# EAGLE design muster#1 (EAGLE 9.1.3)
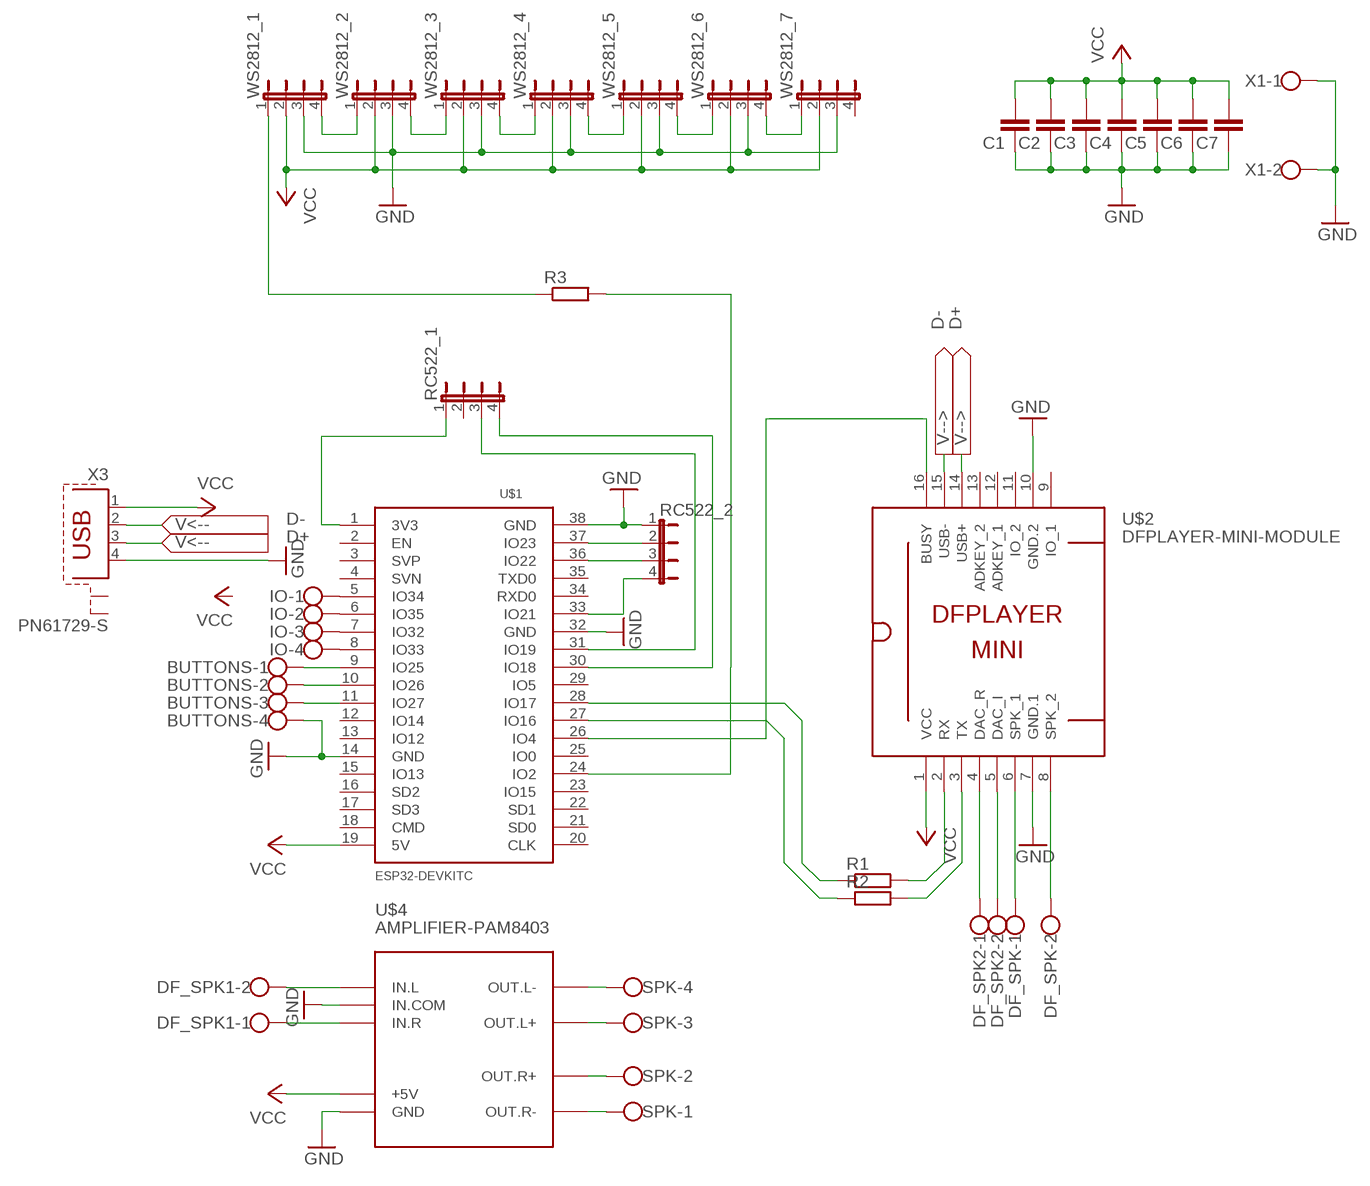
[diagram p0: schematic, sheet 1]

## Parts
BUTTONS  W237-4  [W237-4]
C1  C-EU025-024X044  [C025-024X044]
C2  C-EU025-025X050  [C025-025X050]
C3  C-EU025-025X050  [C025-025X050]
C4  C-EU025-025X050  [C025-025X050]
C5  C-EU025-025X050  [C025-025X050]
C6  C-EU025-025X050  [C025-025X050]
C7  C-EU025-025X050  [C025-025X050]
DF_SPK  W237-02P  [W237-132]
DF_SPK1  W237-02P  [W237-132]
DF_SPK2  W237-02P  [W237-132]
IO  W237-4  [W237-4]
R1  R-EU_0204/2V  [0204V]
R2  R-EU_0204/2V  [0204V]
R3  R-EU_0204/2V  [0204V]
RC522_1  JP4E  [JP4]
RC522_2  JP4E  [JP4]
SPK  W237-4  [W237-4]
U$1  ESP32DEVKITC  [ESP32-DEVKITC]
U$2  DFPLAYER-MINI-MODULE  [DFPLAYER-MINI-MODULE]
U$4  AMPLIFIER-PAM8403  [AMPLIFIER-PAM8403]
WS2812_1  JP4E  [JP4]
WS2812_2  JP4E  [JP4]
WS2812_3  JP4E  [JP4]
WS2812_4  JP4E  [JP4]
WS2812_5  JP4E  [JP4]
WS2812_6  JP4E  [JP4]
WS2812_7  JP4E  [JP4]
X1  W237-102  [W237-102]
X3  PN61729-S  [PN61729-S]

## Nets
D+: U$2.14(USB+) X3.3
D-: U$2.15(USB-) X3.2
GND: BUTTONS.4 C1.1 C2.1 C3.1 C4.1 C5.1 C6.1 C7.1 RC522_2.1 U$1.14(GND) U$1.32(GND) U$1.38(GND) U$2.7(GND.1) U$2.10(GND.2) U$4.GND U$4.IN.COM WS2812_1.3 WS2812_2.3 WS2812_3.3 WS2812_4.3 WS2812_5.3 WS2812_6.3 WS2812_7.3 X1.1 X1.2 X3.4
N$1: DF_SPK.2 U$2.8(SPK_2)
N$2: DF_SPK.1 U$2.6(SPK_1)
N$3: BUTTONS.1 U$1.9(IO25)
N$4: BUTTONS.2 U$1.10(IO26)
N$5: BUTTONS.3 U$1.11(IO27)
N$6: R1.1 U$1.28(IO17)
N$7: R2.1 U$1.27(IO16)
N$8: R2.2 U$2.3(TX)
N$9: WS2812_1.4 WS2812_2.1
N$10: WS2812_2.4 WS2812_3.1
N$11: R1.2 U$2.2(RX)
N$12: SPK.1 U$4.OUT.R-
N$13: DF_SPK2.1 U$2.4(DAC_R)
N$14: R3.1 WS2812_1.1
N$15: SPK.2 U$4.OUT.R+
N$16: SPK.3 U$4.OUT.L+
N$17: SPK.4 U$4.OUT.L-
N$18: WS2812_3.4 WS2812_4.1
N$19: WS2812_4.4 WS2812_5.1
N$20: WS2812_5.4 WS2812_6.1
N$21: WS2812_6.4 WS2812_7.1
N$23: DF_SPK2.2 U$2.5(DAC_I)
N$24: DF_SPK1.2 U$4.IN.L
N$25: DF_SPK1.1 U$4.IN.R
N$26: R3.2 U$1.24(IO2)
N$27: RC522_2.2 U$1.37(IO23)
N$28: U$1.26(IO4) U$2.16(BUSY)
N$29: RC522_2.3 U$1.36(IO22)
N$30: RC522_2.4 U$1.33(IO21)
N$31: RC522_1.3 U$1.31(IO19)
N$32: RC522_1.4 U$1.30(IO18)
N$33: RC522_1.1 U$1.1(3V3)
N$34: IO.1 U$1.5(IO34)
N$35: IO.2 U$1.6(IO35)
N$36: IO.3 U$1.7(IO32)
N$37: IO.4 U$1.8(IO33)
VCC: C1.2 C2.2 C3.2 C4.2 C5.2 C6.2 C7.2 U$1.19(5V) U$2.1(VCC) U$4.+5V WS2812_1.2 WS2812_2.2 WS2812_3.2 WS2812_4.2 WS2812_5.2 WS2812_6.2 WS2812_7.2 X3.1
Unconnected: RC522_1.2 U$1.2(EN) U$1.3(SVP) U$1.4(SVN) U$1.12(IO14) U$1.13(IO12) U$1.15(IO13) U$1.16(SD2) U$1.17(SD3) U$1.18(CMD) U$1.20(CLK) U$1.21(SD0) U$1.22(SD1) U$1.23(IO15) U$1.25(IO0) U$1.29(IO5) U$1.34(RXD0) U$1.35(TXD0) U$2.9(IO_1) U$2.11(IO_2) U$2.12(ADKEY_1) U$2.13(ADKEY_2) WS2812_7.4 X3.S1 X3.S2

## Library data of the parts
BUTTONS IO SPK = con-wago-500:W237-4: WAGO SCREW CLAMP
C1-C7 = resistor:C-EU: CAPACITOR, European symbol
DF_SPK DF_SPK1 DF_SPK2 = con-wago-508:W237-02P: WAGO SREW CLAMP
R1-R3 = rcl:R-EU_: RESISTOR, European symbol
RC522_1 RC522_2 WS2812_1-WS2812_7 = jumper:JP4E: JUMPER
U$1 = ESP32-DEVKITC:ESP32DEVKITC
U$2 = diy-modules:DFPLAYER-MINI-MODULE: DFPlayer Mini - MP3 player module based on YX5200 chip More details available here: https://www.dfrobot.com/wiki/index.php/DFPlayer_Mini_SKU:DFR0299 Click here to find device on ebay.com <http://www.ebay.com/sch/dfplayer+mini>
U$4 = diy-modules:AMPLIFIER-PAM8403: Stereo Class-D 3W Audio Amplifier based on PAM8403 chip More details available here: http://artofcircuits.com/product/pam8403-5v-two-channel-stereo-mini-class-d-3w3w-audio-amplifier Click here to find device on ebay.com <http://www.ebay.com/sch/pam8403+mini+class+d>
X1 = con-wago-500:W237-102: WAGO SCREW CLAMP
X3 = con-berg:PN61729-S: BERG USB connector

## Board
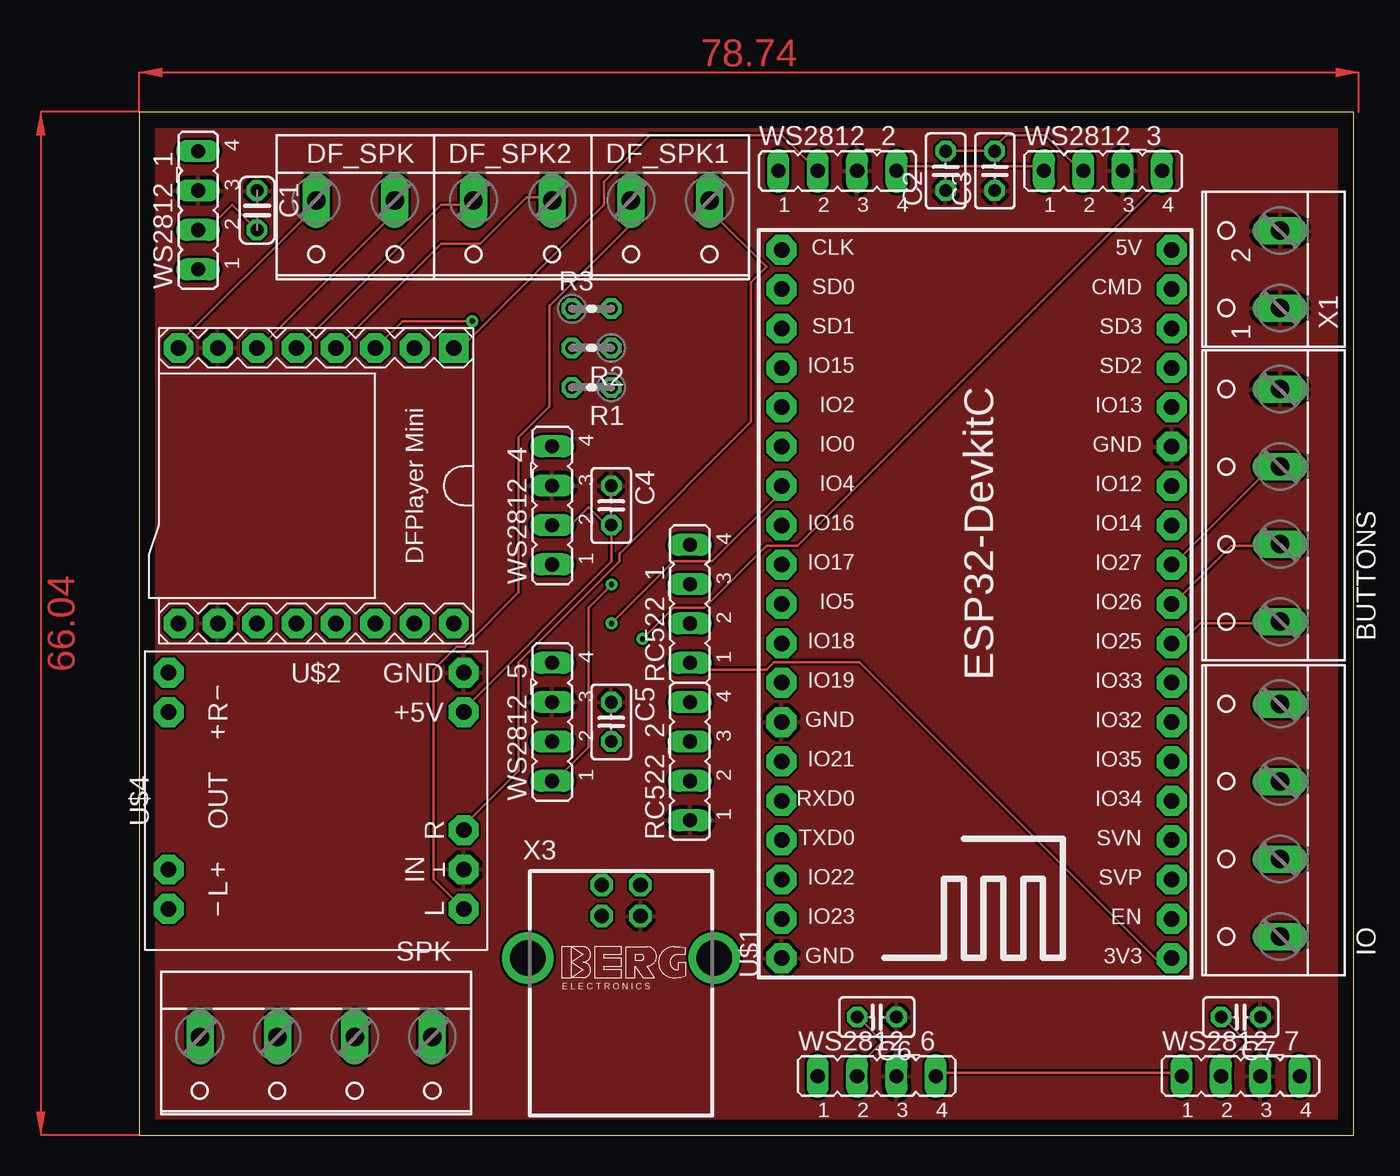
[diagram p1: board, top side]
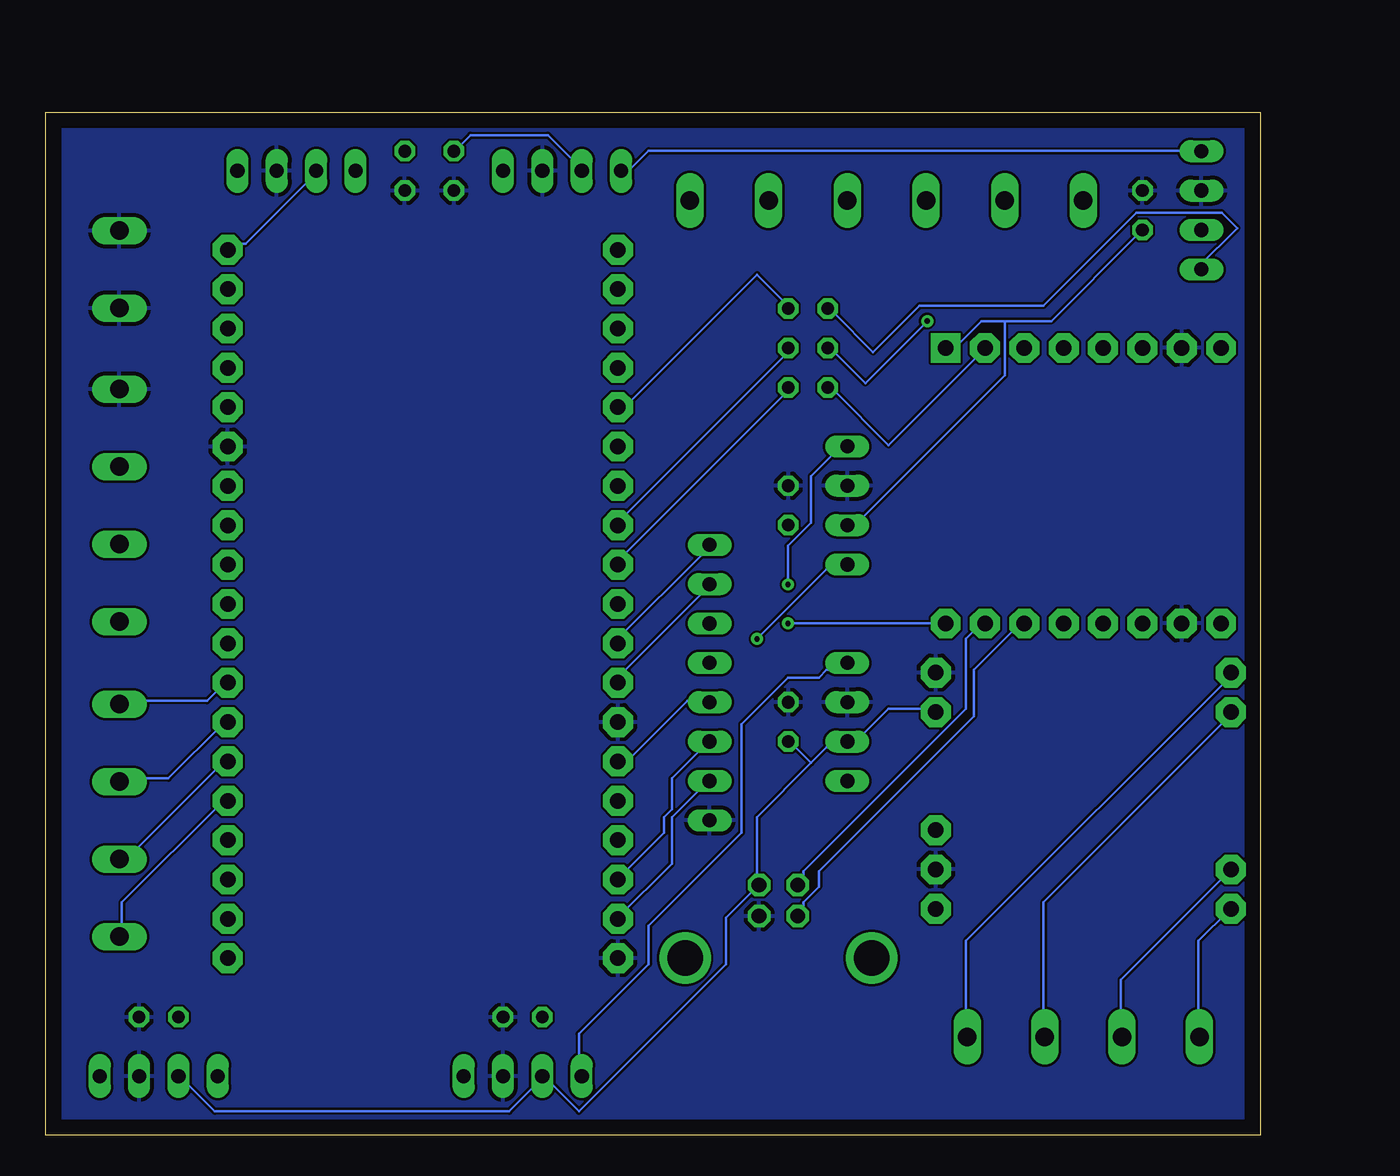
[diagram p2: board, bottom side, seen from below]

Size 78.41 x 66.03 mm. Coordinates in mm from the lower left corner, seen from the top.
Outline: 0,0 78.41,0 78.41,66.03 0,66.03 0,0
Copper layers (1*16): Top 0.035mm / dielectric 1.5mm / Bottom 0.035mm
Design rules "default": minimum track width 6mil, minimum drill 0.35mm, track to track 6mil, track to pad 6mil, pad to pad 6mil, via to via 6mil, smd to smd 6mil, copper to edge 40mil, drill to drill 6mil, minimum pad ring 10mil, minimum via ring 8mil, stop-mask expansion 4mil, vias tented up to drill 0mil, thermal gap 10mil

### Footprints (pad centres in the part's own frame; a part is rotated, then mirrored left to right if it is on the bottom)
W237-4 = drill 1.194 long: 1 -7.5,-1.27; 2 -2.5,-1.27; 3 2.5,-1.27; 4 7.5,-1.27
C025-024X044 = drill 0.813 octagon: 1 -1.27,0; 2 1.27,0
C025-025X050 = drill 0.813 octagon: 1 -1.27,0; 2 1.27,0
W237-132 = drill 1.194 long: 1 -2.54,-0.635; 2 2.54,-0.635
0204V = drill 0.813 octagon: 1 -1.27,0; 2 1.27,0
JP4 = drill 0.914 long: 1 -3.81,0; 2 -1.27,0; 3 1.27,0; 4 3.81,0
ESP32-DEVKITC = drill 1 pad 1.93 octagon: 1 -22.87,-12.69; 2 -20.33,-12.69; 3 -17.79,-12.69; 4 -15.25,-12.69; 5 -12.71,-12.69; 6 -10.17,-12.69; 7 -7.63,-12.69; 8 -5.09,-12.69; 9 -2.55,-12.69; 10 -0.01,-12.69; 11 2.53,-12.69; 12 5.07,-12.69; 13 7.61,-12.69; 14 10.15,-12.69; 15 12.69,-12.69; 16 15.23,-12.69; 17 17.77,-12.69; 18 20.31,-12.69; 19 22.85,-12.69; 20 22.85,12.5; 21 20.31,12.5; 22 17.77,12.5; 23 15.23,12.5; 24 12.69,12.5; 25 10.15,12.5; 26 7.61,12.5; 27 5.07,12.5; 28 2.53,12.5; 29 -0.01,12.5; 30 -2.55,12.5; 31 -5.09,12.5; 32 -7.63,12.5; 33 -10.17,12.5; 34 -12.71,12.5; 35 -15.25,12.5; 36 -17.79,12.5; 37 -20.33,12.5; 38 -22.87,12.5
DFPLAYER-MINI-MODULE = drill 1 pad 1.93 square: 1 -8.89,-8.89 | drill 1 pad 1.93 octagon: 2 -6.35,-8.89; 3 -3.81,-8.89; 4 -1.27,-8.89; 5 1.27,-8.89; 6 3.81,-8.89; 7 6.35,-8.89; 8 8.89,-8.89; 9 8.89,8.89; 10 6.35,8.89; 11 3.81,8.89; 12 1.27,8.89; 13 -1.27,8.89; 14 -3.81,8.89; 15 -6.35,8.89; 16 -8.89,8.89
AMPLIFIER-PAM8403 = drill 1 pad 1.93 octagon: +5V 5.715,-8.89; GND 8.255,-8.89; IN.COM -4.445,-8.89; IN.L -6.985,-8.89; IN.R -1.905,-8.89; OUT.L+ -4.445,10.16; OUT.L- -6.985,10.16; OUT.R+ 5.715,10.16; OUT.R- 8.255,10.16
W237-102 = drill 1.194 long: 1 -2.5,-1.27; 2 2.5,-1.27
PN61729-S = drill 0.95 octagon: 1 1.25,4.71; 2 -1.25,4.71; 3 -1.25,2.71; 4 1.25,2.71 | drill 2.3 pad 2.9: S1 -6.02,0; S2 6.02,0

### Placement (x,y rotation side)
BUTTONS  72.39,40.64 90 top
C1  7.62,59.69 270 top
C2  52.07,62.23 90 top
C3  55.24,62.23 90 top
C4  30.48,40.64 270 top
C5  30.48,26.67 270 top
C6  47.62,7.62 180 top
C7  71.12,7.62 180 top
DF_SPK  13.97,59.69 180 top
DF_SPK1  34.29,59.69 180 top
DF_SPK2  24.13,59.69 180 top
IO  72.39,20.32 90 top
R1  29.21,48.26 180 top
R2  29.21,50.8 180 top
R3  29.21,53.34 0 top
RC522_1  35.56,34.29 90 top
RC522_2  35.56,24.13 90 top
SPK  11.43,5.08 180 top
U$1  53.98,34.29 90 top
U$2  11.43,41.91 180 top
U$4  12.06,21.59 90 top
WS2812_1  3.81,59.69 90 top
WS2812_2  45.09,62.23 0 top
WS2812_3  62.23,62.23 0 top
WS2812_4  26.67,40.64 90 top
WS2812_5  26.67,26.67 90 top
WS2812_6  47.62,3.81 0 top
WS2812_7  71.12,3.81 0 top
X1  72.39,55.88 90 top
X3  31.11,11.43 0 top

### Tracks (layer width: path | path; a pad name or v marks a point on that pad's centre or on a via)
D+
  Bottom 0.152: X3.3 29.5,14.53 29.5,15.03 28.5,16.03 28.5,17.03 18.5,27.03 18.5,30.03 15.5,33.03 U$2.14
D-
  Bottom 0.152: X3.2 29.5,16.53 29.5,17.03 19,27.53 19,32.03 18,33.03 U$2.15
GND
  pour Bottom: 0,66.04 78.74,66.04 78.74,0 0,0
  pour Top: 0,66.04 78.74,66.04 78.74,0 0,0
N$1
  Top 0.152: DF_SPK.2 11,60.03 11,59.53 2.5,51.03 U$2.8
N$2
  Top 0.152: DF_SPK.1 16.5,60.03 16.5,59.53 8,51.03 U$2.6
N$3
  Top 0.152: BUTTONS.1 73.5,33.03 68.5,33.03 67,31.53 U$1.9
N$4
  Top 0.152: BUTTONS.2 73.5,38.03 70.5,38.03 67,34.53 U$1.10
N$5
  Top 0.152: BUTTONS.3 73.5,43.03 73,43.03 67,37.03 U$1.11
N$6
  Bottom 0.152: R1.1 30.5,48.03 41.5,37.03 U$1.28
N$7
  Bottom 0.152: R2.1 30.5,50.53 41.5,39.53 U$1.27
N$8  (via drill 0.35)
  Top 0.152: v21.5,52.53 17,52.53 15.5,51.03 U$2.3
  Bottom 0.152: v21.5,52.53 25.5,48.53 27.5,50.53 R2.2
N$9
  Bottom 0.152: WS2812_1.4 4,63.53 39.5,63.53 41,62.03 WS2812_2.1
N$10
  Top 0.152: WS2812_2.4 49,62.53 58,62.53 WS2812_3.1
N$11
  Bottom 0.152: R1.2 27.5,48.03 24,44.53 18,50.53 U$2.2
N$12
  Bottom 0.152: SPK.1 19,6.53 19,12.53 2,29.53 U$4.OUT.R-
N$13
  Top 0.152: DF_SPK2.1 26.5,60.53 25,60.53 22,57.53 19.5,57.53 13,51.03 U$2.4
N$14
  Bottom 0.152: R3.1 27.5,53.03 25,50.53 22,53.53 14,53.53 8,59.53 2.5,59.53 1.5,58.53 4,56.03 WS2812_1.1
N$15
  Bottom 0.152: SPK.2 14,6.53 14,15.03 2,27.03 U$4.OUT.R+
N$16
  Bottom 0.152: SPK.3 9,6.53 9,10.03 2,17.03 U$4.OUT.L+
N$17
  Bottom 0.152: SPK.4 4,6.53 4,12.53 2,14.53 U$4.OUT.L-
N$18  (via drill 0.35)
  Top 0.152: v32.5,32.03 34.5,34.03 36.5,34.03 40.5,38.03 42.5,38.03 65.5,61.03 65.5,61.53 66,62.03 WS2812_3.4
  Bottom 0.152: v32.5,32.03 28,36.53 27,36.53 WS2812_4.1
N$19  (via drill 0.35)
  Top 0.152: v30.5,35.53 29,34.03 29,25.03 27,23.03 WS2812_5.1
  Bottom 0.152: v30.5,35.53 30.5,38.03 29,39.53 29,42.53 27,44.53 WS2812_4.4
N$20
  Bottom 0.152: WS2812_6.1 44,4.03 44,6.53 39.5,11.03 39.5,13.53 33.5,19.53 33.5,26.53 30.5,29.53 28.5,29.53 28,30.03 27,30.03 WS2812_5.4
N$21
  Top 0.152: WS2812_6.4 51.5,4.03 67,4.03 WS2812_7.1
N$23
  Top 0.152: DF_SPK2.2 21.5,60.03 19.5,60.03 10.5,51.03 U$2.5
N$24
  Top 0.152: DF_SPK1.2 31.5,60.03 31.5,58.53 26.5,53.53 26.5,47.03 24.5,45.03 24.5,35.03 21,31.53 20.5,31.53 19,30.03 19,16.53 20.5,15.03 U$4.IN.L
N$25
  Top 0.152: DF_SPK1.1 37,60.03 37,59.53 40.5,56.03 39.5,55.03 39.5,46.03 31,37.53 31,37.03 24.5,30.53 24.5,23.53 21,20.03 U$4.IN.R
N$26
  Bottom 0.152: R3.2 30.5,53.53 32.5,55.53 41,47.03 U$1.24
N$27
  Bottom 0.152: RC522_2.2 36,22.53 38,20.53 38,17.53 41.5,14.03 U$1.37
N$28  (via drill 0.35)
  Top 0.152: v30.5,33.03 34.5,37.03 37,37.03 41.5,41.53 U$1.26
  Bottom 0.152: v30.5,33.03 20.5,33.03 U$2.16
N$29
  Bottom 0.152: RC522_2.3 36,25.03 38,23.03 38,21.03 38.5,20.53 38.5,19.53 41.5,16.53 U$1.36
N$30
  Bottom 0.152: RC522_2.4 36,28.03 37,28.03 41,24.03 U$1.33
N$31
  Bottom 0.152: RC522_1.3 36,35.53 36,35.03 41.5,29.53 U$1.31
N$32
  Bottom 0.152: RC522_1.4 36,38.03 36,37.53 41.5,32.03 U$1.30
N$33
  Top 0.152: RC522_1.1 36,30.03 40.5,30.03 41,30.53 46.5,30.53 66,11.03 66.5,11.53 U$1.1
N$34
  Bottom 0.152: IO.1 73.5,13.03 73.5,15.03 67,21.53 U$1.5
N$35
  Bottom 0.152: IO.2 73.5,18.03 73,18.03 67,24.03 U$1.6
N$36
  Bottom 0.152: IO.3 73.5,23.03 70.5,23.03 67,26.53 U$1.7
N$37
  Bottom 0.152: IO.4 73.5,28.03 68,28.03 67,29.03 U$1.8
VCC
  Top 0.152: 55,63.53 52.5,63.53 C2.2 | 55,63.53 C3.2 55,63.53 | 55,63.53 56,64.53 58.5,64.53 60.5,62.53 WS2812_3.2 | C1.2 7.5,58.53 6,60.03 4,58.03 WS2812_1.2 | C7.2 70,7.53 71.5,6.03 69.5,4.03 WS2812_7.2 | C6.2 46.5,7.53 48,6.03 46,4.03 WS2812_6.2 | WS2812_4.2 27,39.53 28,39.53 29,40.53 30,39.53 C4.2 30.5,39.03 30.5,37.03 21,27.53 U$4.+5V | WS2812_2.2 43.5,62.53 41.5,64.53 33,64.53 30,61.53 30,60.03 20.5,50.53 U$2.1
  Bottom 0.152: WS2812_3.2 61,62.03 65.5,57.53 66.5,57.53 U$1.19 | WS2812_2.2 44,62.53 46,64.53 51,64.53 52,63.53 C2.2 | 16.5,52.53 13.5,52.53 8,58.03 C1.2 | 16.5,52.53 18,52.53 19.5,51.03 20,51.03 U$2.1 | 29,24.03 30,25.03 C5.2 | 29,24.03 28,25.03 27,25.03 WS2812_5.2 26.5,25.03 24,27.53 21,27.53 U$4.+5V | 29,24.03 32.5,20.53 32.5,16.53 X3.1 32.5,16.03 34.5,14.03 34.5,11.03 44,1.53 46,3.53 WS2812_6.2 46.5,3.53 48.5,1.53 67.5,1.53 69.5,3.53 WS2812_7.2 | 16.5,52.53 16.5,49.03 26.5,39.03 WS2812_4.2
(copper drawn outside any net)
  shapes: Top area x2